# Altium schematic sheet testconnectors.SchDoc
size 297 x 209 mm
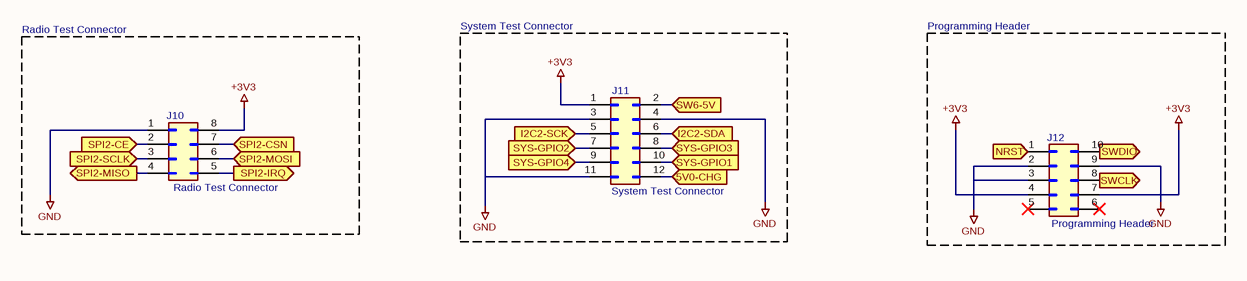
[diagram p0: testconnectors.SchDoc]

## Parts
J10  Radio Test Connector  [PinSocket_2x04_P2.54mm_Vertical]
J11  System Test Connector  [PinSocket_2x06_P2.54mm_Horizontal]
J12  Programming Header  [PinSocket_2x05_P2.54mm_Horizontal]

## Blocks framed on the sheet
Radio Test Connector: J10
System Test Connector: J11
Programming Header: J12

## Ports
5V0-CHG (in), I2C2-SCK (in), I2C2-SDA (in), NRST (in), SPI2-CE (in), SPI2-CSN (in), SPI2-IRQ (out), SPI2-MISO (out), SPI2-MOSI (in), SPI2-SCLK (in), SW6-5V (in), SWCLK (in), SWDIO (in), SYS-GPIO1 (in), SYS-GPIO2 (in), SYS-GPIO3 (in), SYS-GPIO4 (in)

## Nets
+3V3: J10.8(Pin_8) J11.1(Pin_1) J12.4(Pin_4) J12.7(Pin_7)
GND: J10.1(Pin_1) J11.3(Pin_3) J11.4(Pin_4) J11.11(Pin_11) J12.2(Pin_2) J12.3(Pin_3) J12.9(Pin_9)
5V0-CHG: J11.12(Pin_12) ; port 5V0-CHG
I2C2-SCK: J11.5(Pin_5) ; port I2C2-SCK
I2C2-SDA: J11.6(Pin_6) ; port I2C2-SDA
NRST: J12.1(Pin_1) ; port NRST
SPI2-CE: J10.2(Pin_2) ; port SPI2-CE
SPI2-CSN: J10.7(Pin_7) ; port SPI2-CSN
SPI2-IRQ: J10.5(Pin_5) ; port SPI2-IRQ
SPI2-MISO: J10.4(Pin_4) ; port SPI2-MISO
SPI2-MOSI: J10.6(Pin_6) ; port SPI2-MOSI
SPI2-SCLK: J10.3(Pin_3) ; port SPI2-SCLK
SW6-5V: J11.2(Pin_2) ; port SW6-5V
SWCLK: J12.8(Pin_8) ; port SWCLK
SWDIO: J12.10(Pin_10) ; port SWDIO
SYS-GPIO1: J11.10(Pin_10) ; port SYS-GPIO1
SYS-GPIO2: J11.7(Pin_7) ; port SYS-GPIO2
SYS-GPIO3: J11.8(Pin_8) ; port SYS-GPIO3
SYS-GPIO4: J11.9(Pin_9) ; port SYS-GPIO4

Not connected (* = marked no-connect by the designer): J12 5(Pin_5)* 6(Pin_6)*

## Notes on the sheet
- 1
- 2
- 3
- 4
- 5
- 6
- A
- B
- C
- D
- Title:
- File: testconnectors.kicad_sch
- Sheet: /
- KiCad E.D.A.  kicad (5.1.4)-1
- Size: A4
- Date:
- Rev:
- Id: 1/1

## Library data of the parts
J10 = Conn_02x04_Counter_Clockwise: Value: Radio Test Connector; Footprint: Connector_PinSocket_2.54mm:PinSocket_2x04_P2.54mm_Vertical
J11 = Conn_02x06_Odd_Even: Value: System Test Connector; Footprint: Connector_PinSocket_2.54mm:PinSocket_2x06_P2.54mm_Horizontal
J12 = Conn_02x05_Counter_Clockwise: Value: Programming Header; Footprint: Connector_PinSocket_2.54mm:PinSocket_2x05_P2.54mm_Horizontal